# EAGLE design MPPT (EAGLE 7.2.0)
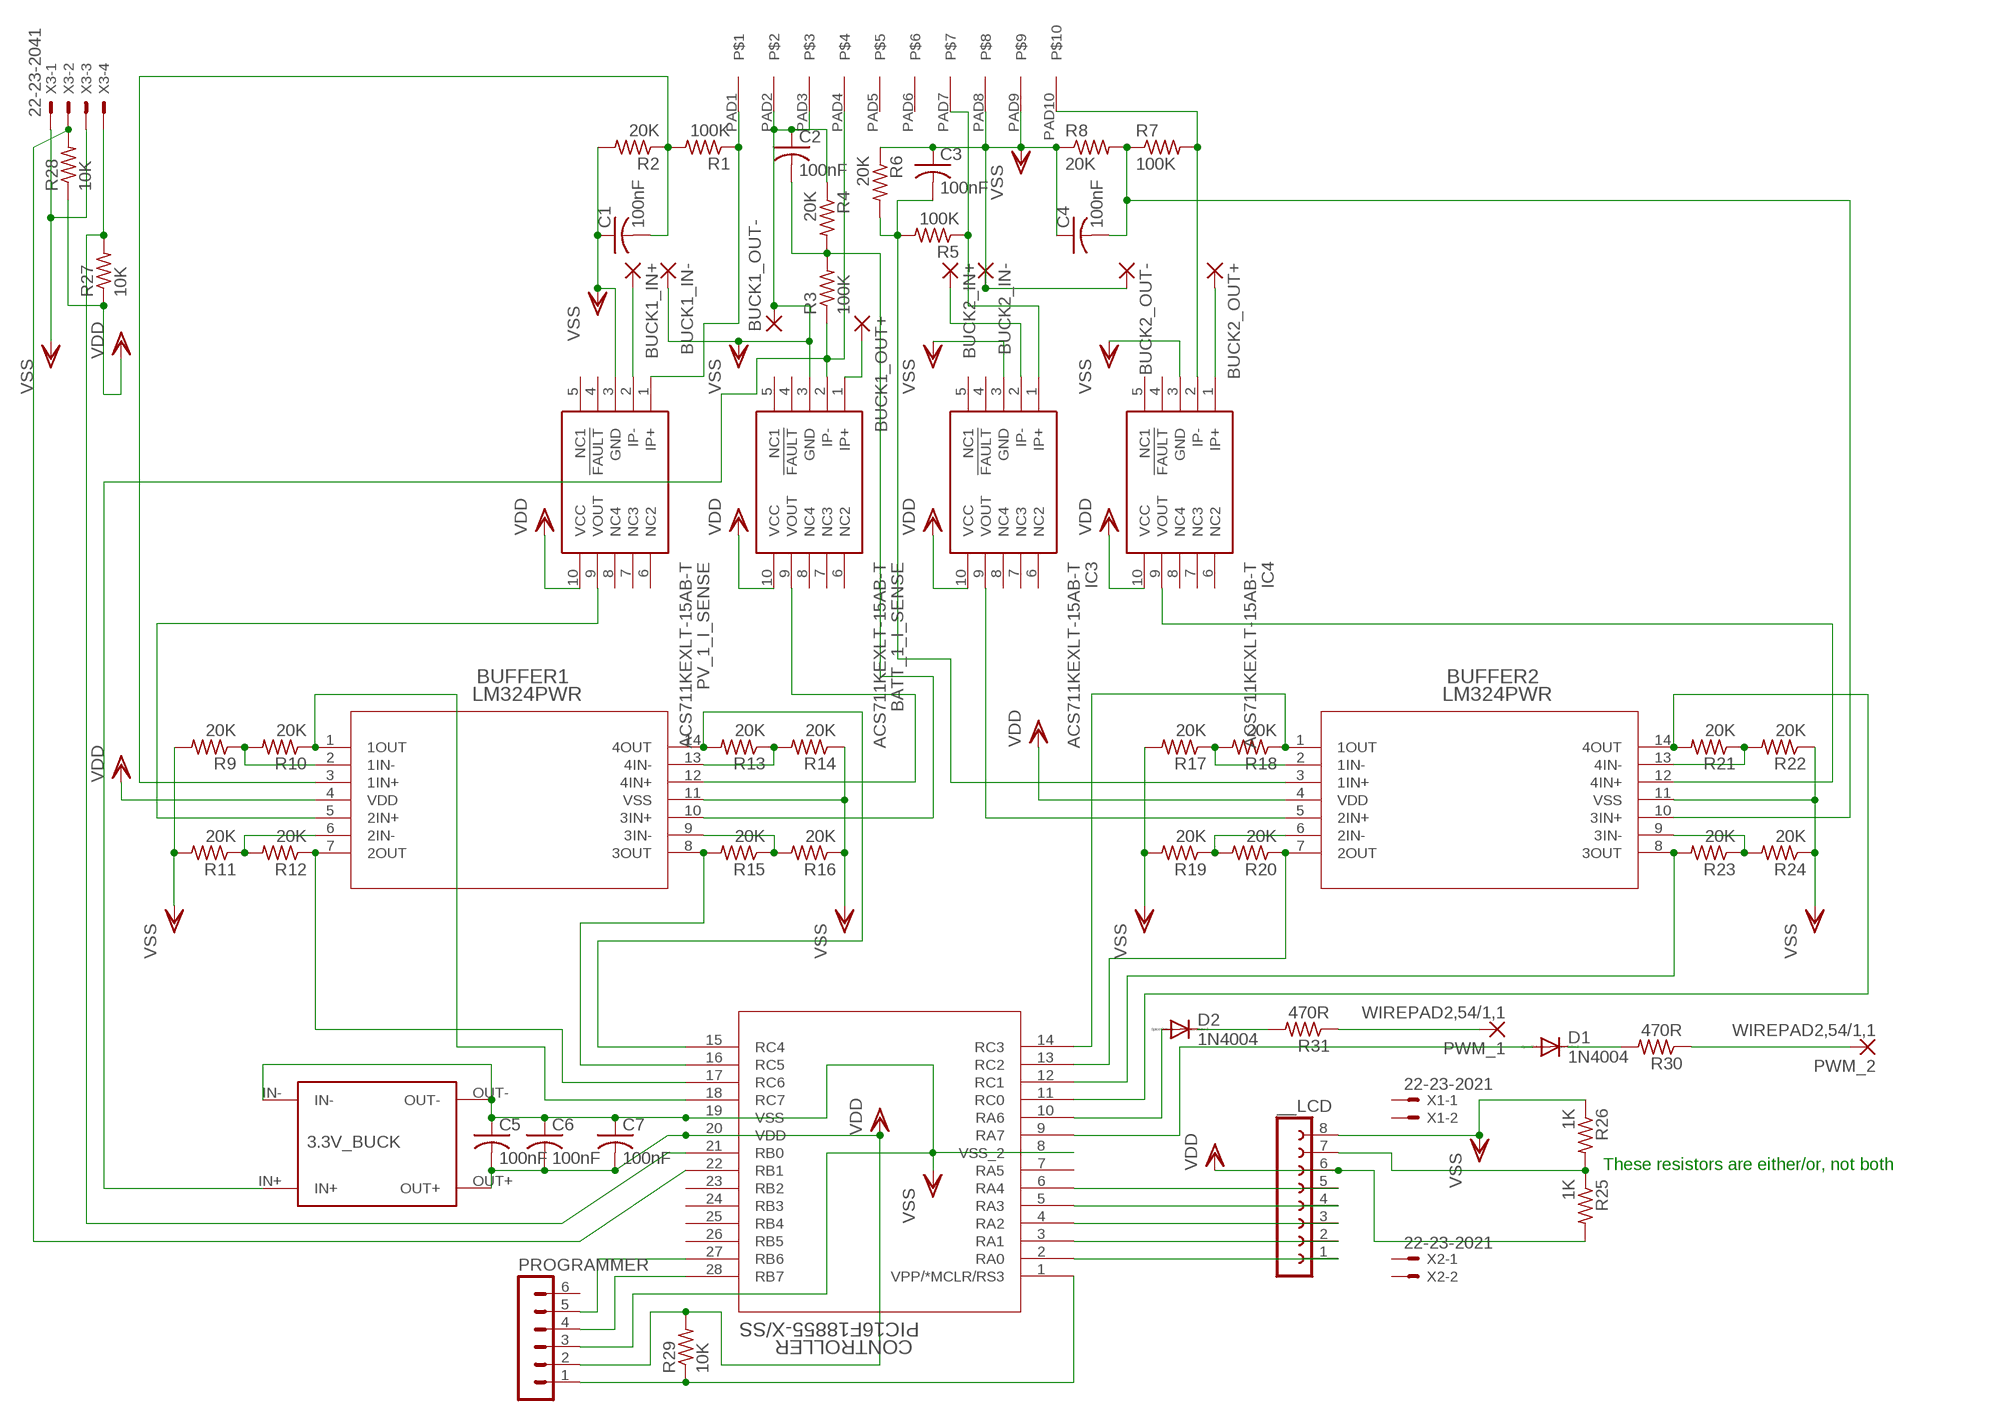
[diagram p0: schematic, sheet 1]

## Parts
3.3V_BUCK  TINY_BUCK  [TINY_BUCK]
__LCD  FE08-1  [FE08]
BATT_1_I_SENSE  ACS711KEXLT-15AB-T  [EX-PACKAGE]
BUCK1_IN+  3,81/1,4  [3,81/1,4]
BUCK1_IN-  3,81/1,4  [3,81/1,4]
BUCK1_OUT+  3,81/1,4  [3,81/1,4]
BUCK1_OUT-  3,81/1,4  [3,81/1,4]
BUCK2_IN+  3,81/1,4  [3,81/1,4]
BUCK2_IN-  3,81/1,4  [3,81/1,4]
BUCK2_OUT+  3,81/1,4  [3,81/1,4]
BUCK2_OUT-  3,81/1,4  [3,81/1,4]
BUFFER1  LM324PWR  [PW14]
BUFFER2  LM324PWR  [PW14]
C1  100nF  C-USC0603  [C0603]
C2  100nF  C-USC0603  [C0603]
C3  100nF  C-USC0603  [C0603]
C4  100nF  C-USC0603  [C0603]
C5  100nF  C-USC0603  [C0603]
C6  100nF  C-USC0603  [C0603]
C7  100nF  C-USC0603  [C0603]
CONTROLLER  PIC16F18855-X/SS  [SSOP28_MC]
D1  1N4004  [DO41-10]
D2  1N4004  [DO41-10]
IC3  ACS711KEXLT-15AB-T  [EX-PACKAGE]
IC4  ACS711KEXLT-15AB-T  [EX-PACKAGE]
PROGRAMMER  MA06-1  [MA06-1]
PV_1_I_SENSE  ACS711KEXLT-15AB-T  [EX-PACKAGE]
PWM_1  WIREPAD2,54/1,1  [2,54/1,1]
PWM_2  WIREPAD2,54/1,1  [2,54/1,1]
R1  100K  R-US_R0603  [R0603]
R2  20K  R-US_R0603  [R0603]
R3  100K  R-US_R0603  [R0603]
R4  20K  R-US_R0603  [R0603]
R5  100K  R-US_R0603  [R0603]
R6  20K  R-US_R0603  [R0603]
R7  100K  R-US_R0603  [R0603]
R8  20K  R-US_R0603  [R0603]
R9  20K  R-US_R0603  [R0603]
R10  20K  R-US_R0603  [R0603]
R11  20K  R-US_R0603  [R0603]
R12  20K  R-US_R0603  [R0603]
R13  20K  R-US_R0603  [R0603]
R14  20K  R-US_R0603  [R0603]
R15  20K  R-US_R0603  [R0603]
R16  20K  R-US_R0603  [R0603]
R17  20K  R-US_R0603  [R0603]
R18  20K  R-US_R0603  [R0603]
R19  20K  R-US_R0603  [R0603]
R20  20K  R-US_R0603  [R0603]
R21  20K  R-US_R0603  [R0603]
R22  20K  R-US_R0603  [R0603]
R23  20K  R-US_R0603  [R0603]
R24  20K  R-US_R0603  [R0603]
R25  1K  R-US_R0603  [R0603]
R26  1K  R-US_R0603  [R0603]
R27  10K  R-US_R1206  [R1206]
R28  10K  R-US_R0603  [R0603]
R29  10K  R-US_R0603  [R0603]
R30  470R  R-US_R0603  [R0603]
R31  470R  R-US_R1206  [R1206]
U$1  CONN-KF2EDG-10(5.08)E-BAYPLUGGABLECONNECTORS  [CONN-KF2EDG-10(5.08)]
X1  22-23-2021  [22-23-2021]
X2  22-23-2021  [22-23-2021]
X3  22-23-2041  [22-23-2041]

## Nets
N$1: PV_1_I_SENSE.1(IP+) R1.1 U$1.PAD1
N$2: BUFFER1.5(2IN+) PV_1_I_SENSE.9(VOUT)
N$3: BUFFER1.3(1IN+) C1.2 R1.2 R2.1
N$4: BATT_1_I_SENSE.1(IP+) BUCK1_OUT+.1(P)
N$5: BUFFER1.10(3IN+) C2.2 R3.2 R4.2
N$6: 3.3V_BUCK.IN+ BATT_1_I_SENSE.2(IP-) R3.1 U$1.PAD4
N$7: BUCK2_OUT+.1(P) IC4.1(IP+)
N$8: IC3.1(IP+) R5.1 U$1.PAD7
N$9: BUCK2_IN+.1(P) IC3.2(IP-)
N$10: BUFFER2.3(1IN+) C3.2 R5.2 R6.2
N$11: IC4.2(IP-) R7.2 U$1.PAD10
N$12: BUFFER2.10(3IN+) C4.2 R7.1 R8.2
N$13: BUCK1_IN+.1(P) PV_1_I_SENSE.2(IP-)
N$14: BUFFER1.9(3IN-) R15.1 R16.2
N$15: BUFFER1.1(1OUT) CONTROLLER.18(RC7) R10.1
N$16: BUFFER1.6(2IN-) R11.1 R12.2
N$17: BUFFER1.7(2OUT) CONTROLLER.17(RC6) R12.1
N$18: BUFFER1.13(4IN-) R13.1 R14.2
N$19: BUFFER1.2(1IN-) R9.1 R10.2
N$20: BUFFER1.14(4OUT) CONTROLLER.15(RC4) R13.2
N$21: BUFFER1.8(3OUT) CONTROLLER.16(RC5) R15.2
N$22: BATT_1_I_SENSE.9(VOUT) BUFFER1.12(4IN+)
N$23: __LCD.1 CONTROLLER.2(RA0)
N$24: BUFFER2.1(1OUT) CONTROLLER.14(RC3) R18.1
N$25: BUFFER2.7(2OUT) CONTROLLER.13(RC2) R20.1
N$26: BUFFER2.6(2IN-) R19.1 R20.2
N$27: BUFFER2.14(4OUT) CONTROLLER.11(RC0) R21.2
N$28: BUFFER2.13(4IN-) R21.1 R22.2
N$29: BUFFER2.8(3OUT) CONTROLLER.12(RC1) R23.2
N$30: BUFFER2.9(3IN-) R23.1 R24.2
N$31: BUFFER2.2(1IN-) R17.1 R18.2
N$32: BUFFER2.5(2IN+) IC3.9(VOUT)
N$33: BUFFER2.12(4IN+) IC4.9(VOUT)
N$34: __LCD.2 CONTROLLER.3(RA1)
N$35: __LCD.3 CONTROLLER.4(RA2)
N$36: __LCD.4 CONTROLLER.5(RA3)
N$37: __LCD.5 CONTROLLER.6(RA4)
N$38: __LCD.7 R25.1 R26.2
N$39: CONTROLLER.22(RB1) R28.2 X3.2
N$40: CONTROLLER.1(VPP/*MCLR/RS3) PROGRAMMER.1 R29.1
N$41: CONTROLLER.10(RA6) D2.A
N$42: CONTROLLER.21(RB0) R27.2 X3.4
N$43: CONTROLLER.9(RA7) D1.A
N$44: CONTROLLER.28(RB7) PROGRAMMER.4
N$45: CONTROLLER.27(RB6) PROGRAMMER.5
N$46: PWM_2.1(P) R30.1
N$47: D1.C R30.2
N$48: PWM_1.1(P) R31.1
N$49: D2.C R31.2
VDD: 3.3V_BUCK.OUT+ __LCD.6 BATT_1_I_SENSE.10(VCC) BUFFER1.4(VDD) BUFFER2.4(VDD) C5.2 C6.2 C7.2 CONTROLLER.20(VDD) IC3.10(VCC) IC4.10(VCC) PROGRAMMER.2 PV_1_I_SENSE.10(VCC) R25.2 R27.1 R28.1 R29.2
VSS: 3.3V_BUCK.IN- 3.3V_BUCK.OUT- __LCD.8 BATT_1_I_SENSE.3(GND) BUCK1_IN-.1(P) BUCK1_OUT-.1(P) BUCK2_IN-.1(P) BUCK2_OUT-.1(P) BUFFER1.11(VSS) BUFFER2.11(VSS) C1.1 C2.1 C3.1 C4.1 C5.1 C6.1 C7.1 CONTROLLER.8(VSS_2) CONTROLLER.19(VSS) IC3.3(GND) IC4.3(GND) PROGRAMMER.3 PV_1_I_SENSE.3(GND) R2.2 R4.1 R6.1 R8.1 R9.2 R11.2 R14.1 R16.1 R17.2 R19.2 R22.1 R24.1 R26.1 U$1.PAD2 U$1.PAD3 U$1.PAD8 U$1.PAD9 X3.1 X3.3
Unconnected: BATT_1_I_SENSE.4(!FAULT) BATT_1_I_SENSE.5(NC1) BATT_1_I_SENSE.6(NC2) BATT_1_I_SENSE.7(NC3) BATT_1_I_SENSE.8(NC4) CONTROLLER.7(RA5) CONTROLLER.23(RB2) CONTROLLER.24(RB3) CONTROLLER.25(RB4) CONTROLLER.26(RB5) IC3.4(!FAULT) IC3.5(NC1) IC3.6(NC2) IC3.7(NC3) IC3.8(NC4) IC4.4(!FAULT) IC4.5(NC1) IC4.6(NC2) IC4.7(NC3) IC4.8(NC4) PROGRAMMER.6 PV_1_I_SENSE.4(!FAULT) PV_1_I_SENSE.5(NC1) PV_1_I_SENSE.6(NC2) PV_1_I_SENSE.7(NC3) PV_1_I_SENSE.8(NC4) U$1.PAD5 U$1.PAD6 X1.1 X1.2 X2.1 X2.2

## Notes on the sheet
- These resistors are either/or, not both

## Library data of the parts
3.3V_BUCK = Tiny_Buck:TINY_BUCK: E_Bay 3 Amp Buck Converter
__LCD = con-lsta:FE08-1: FEMALE HEADER; OC_FARNELL: unknown; OC_NEWARK: unknown
BATT_1_I_SENSE IC3 IC4 PV_1_I_SENSE = SamacSys_Parts:ACS711KEXLT-15AB-T: Hall Effect Linear Current Sensor with Overcurrent Fault Output for <100 V Isolation Applications Source: Datasheet <https://www.arrow.com/en/products/acs711kexlt-15ab-t/allegro-microsystems>; ARROW_PART_NUMBER: ACS711KEXLT-15AB-T; DESCRIPTION: Hall Effect Linear Current Sensor with Overcurrent Fault Output for <100 V Isolation Applications; HEIGHT: mm; MANUFACTURER_NAME: Allegro Microsystems; MANUFACTURER_PART_NUMBER: ACS711KEXLT-15AB-T
BUCK1_IN+ BUCK1_IN- BUCK1_OUT+ BUCK1_OUT- BUCK2_IN+ BUCK2_IN- BUCK2_OUT+ BUCK2_OUT- = wirepad:3,81/1,4: THROUGH-HOLE PAD
BUFFER1 BUFFER2 = LM324PWR:LM324PWR; MANUFACTURER_PART_NUMBER: LM324PWR; VENDOR: Vendor
C1-C7 = resistor:C-US: CAPACITOR, American symbol
CONTROLLER = 16F18855_SSOP:PIC16F18855-X/SS; COPYRIGHT: Copyright (C) 2016 Accelerated Designs. All rights reserved; MANUFACTURER_PART_NUMBER: pic16f18855-x/ss; VENDOR: Microchip
D1 D2 = diode:1N4004: DIODE general purpose rectifier, 1 A
PROGRAMMER = con-lstb:MA06-1: PIN HEADER; OC_FARNELL: unknown; OC_NEWARK: unknown
PWM_1 PWM_2 = wirepad:WIREPAD: Wire PAD connect wire on PCB
R1-R26 R28-R31 = resistor:R-US_: RESISTOR, American symbol
R27 = rcl:R-US_: RESISTOR, American symbol
U$1 = Stuff_I_Use:CONN-KF2EDG-10(5.08)
X1 X2 = con-molex:22-23-2021: .100" (2.54mm) Center Header - 2 Pin; MF: MOLEX; MPN: 22-23-2021; OC_FARNELL: 1462926; OC_NEWARK: 25C3832
X3 = con-molex:22-23-2041: .100" (2.54mm) Center Header - 4 Pin; MF: MOLEX; MPN: 22-23-2041; OC_FARNELL: 1462920; OC_NEWARK: 38C0355

## Board
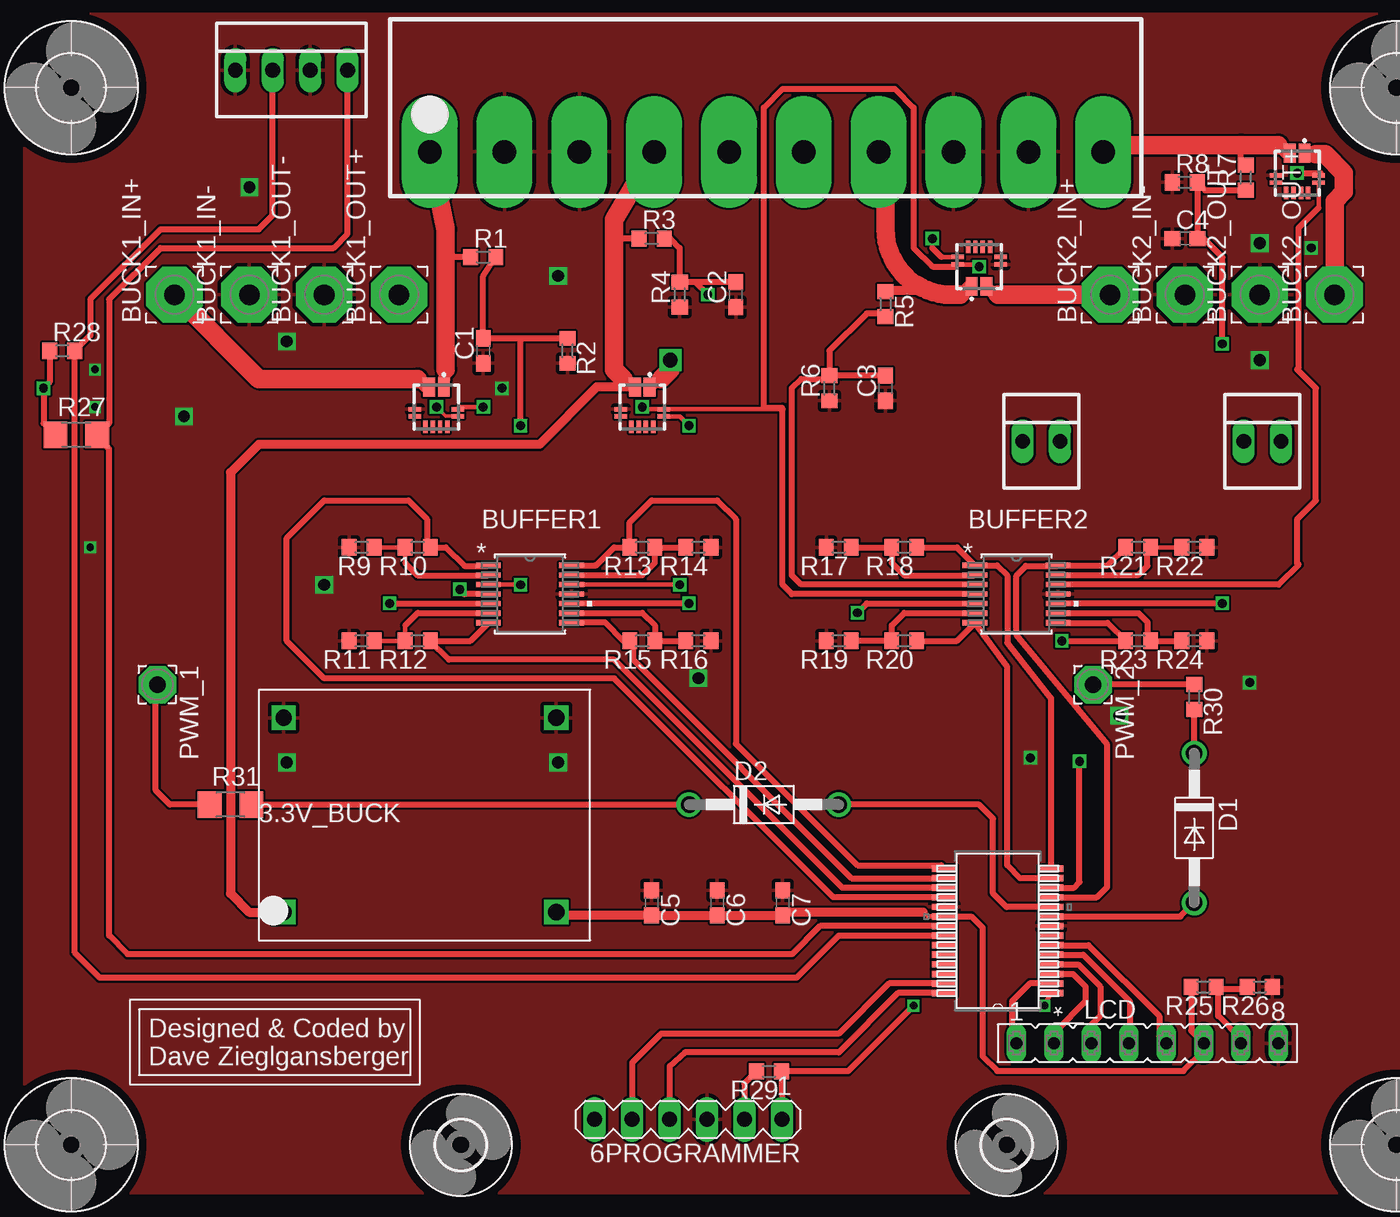
[diagram p1: board, top side]
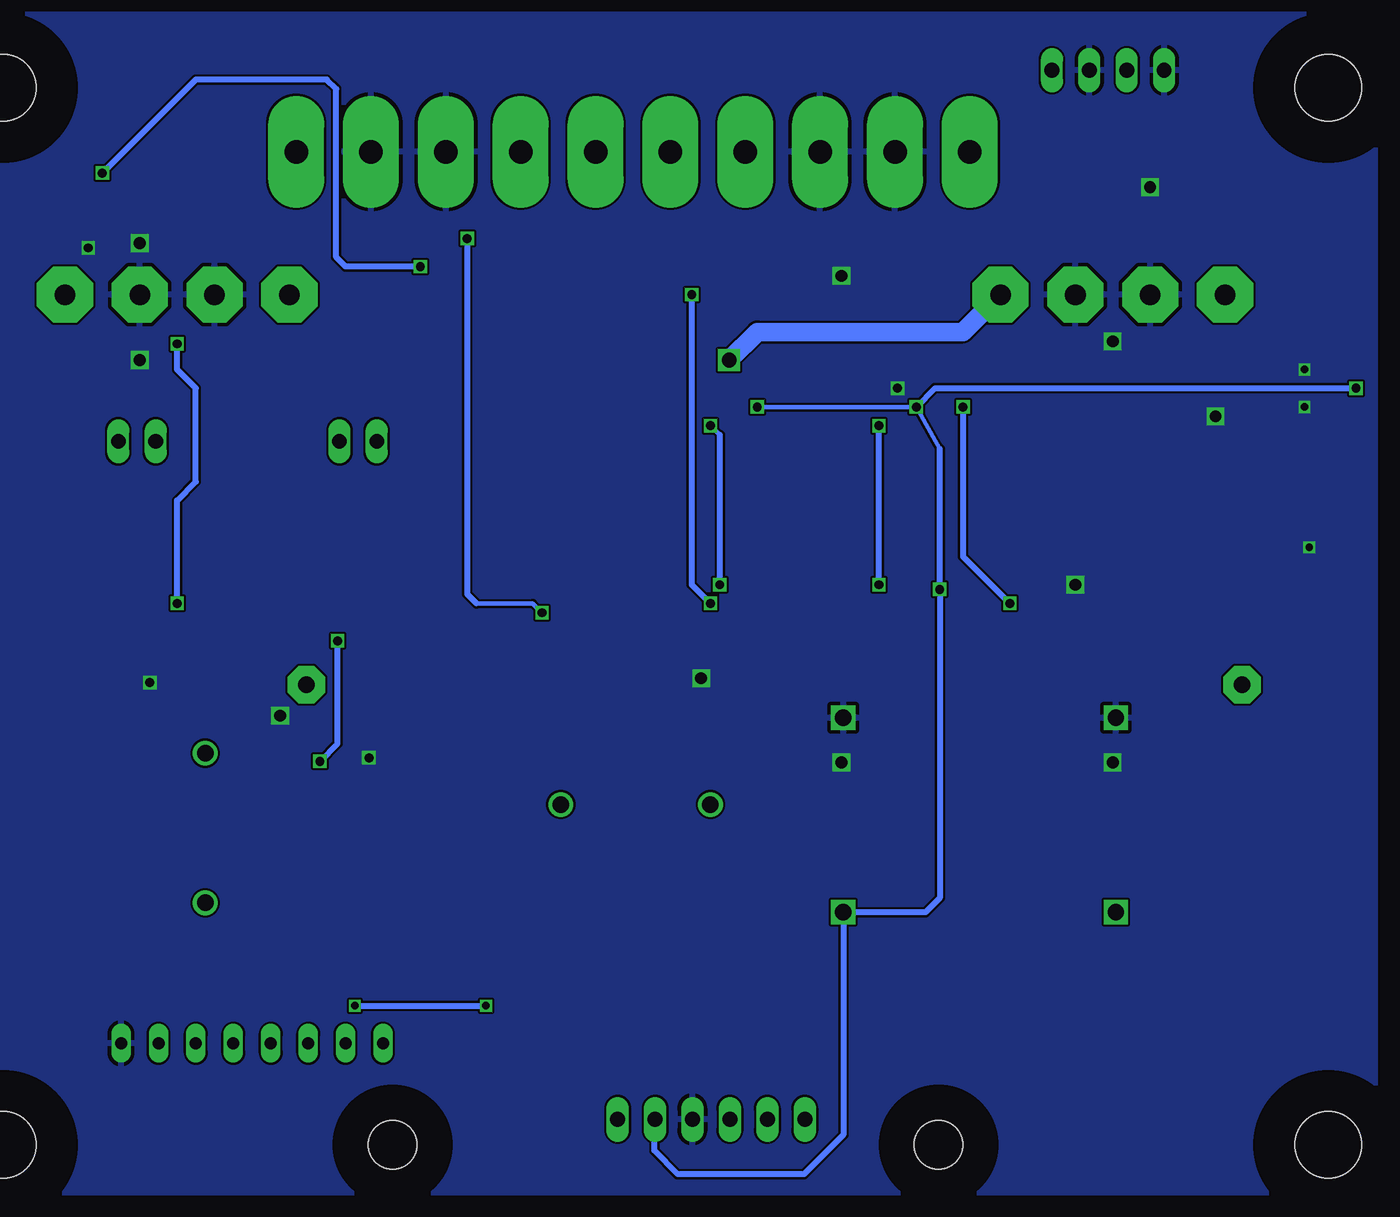
[diagram p2: board, bottom side, seen from below]

No outline drawn. Coordinates in mm, seen from the top.
Copper layers (1*16): Top 0.035mm / dielectric 1.5mm / Bottom 0.035mm
Design rules "SeeedStudio_2layer_DRU_no_angle_20140221 *": minimum track width 6mil, minimum drill 12mil, track to track 6mil, track to pad 6mil, pad to pad 6mil, via to via 6mil, smd to smd 0mil, copper to edge 10mil, drill to drill 10mil, minimum pad ring 10mil, minimum via ring 6mil, stop-mask expansion 2mil, vias tented up to drill 100mil, thermal gap 10mil

### Footprints (pad centres in the part's own frame; a part is rotated, then mirrored left to right if it is on the bottom)
TINY_BUCK = drill 1.1 square: IN+ 1.7,1.9; IN- 1.7,15.1; OUT+ 20.2,1.9; OUT- 20.2,15.1
FE08 = drill 0.813 long: 1 -8.89,0; 2 -6.35,0; 3 -3.81,0; 4 -1.27,0; 5 1.27,0; 6 3.81,0; 7 6.35,0; 8 8.89,0
EX-PACKAGE = smd 1.27 x 0.8: 1 -1.35,0.5; 2 -1.35,-0.5 | smd 0.3 x 0.85: 3 0.15,-1.45; 4 0.65,-1.45; 9 0.65,1.45; 10 0.15,1.45 | smd 0.85 x 0.3: 5 1.35,-0.75; 6 1.35,-0.25; 7 1.35,0.25; 8 1.35,0.75
3,81/1,4 = drill 1.397 pad 3.81 octagon: 1 0,0
PW14 = smd 1.676 x 0.356: 1 -2.819,1.95; 2 -2.819,1.3; 3 -2.819,0.65; 4 -2.819,0; 5 -2.819,-0.65; 6 -2.819,-1.3; 7 -2.819,-1.95; 8 2.819,-1.95; 9 2.819,-1.3; 10 2.819,-0.65; 11 2.819,0; 12 2.819,0.65; 13 2.819,1.3; 14 2.819,1.95
C0603 = smd 1.1 x 1: 1 -0.85,0; 2 0.85,0
SSOP28_MC = smd 1.676 x 0.432: 1 -3.619,4.225; 2 -3.619,3.575; 3 -3.619,2.925; 4 -3.619,2.275; 5 -3.619,1.625; 6 -3.619,0.975; 7 -3.619,0.325; 8 -3.619,-0.325; 9 -3.619,-0.975; 10 -3.619,-1.625; 11 -3.619,-2.275; 12 -3.619,-2.925; 13 -3.619,-3.575; 14 -3.619,-4.225; 15 3.619,-4.225; 16 3.619,-3.575; 17 3.619,-2.925; 18 3.619,-2.275; 19 3.619,-1.625; 20 3.619,-0.975; 21 3.619,-0.325; 22 3.619,0.325; 23 3.619,0.975; 24 3.619,1.625; 25 3.619,2.275; 26 3.619,2.925; 27 3.619,3.575; 28 3.619,4.225
DO41-10 = drill 1.118: A 5.08,0; C -5.08,0
MA06-1 = drill 1.016 long: 1 -6.35,0; 2 -3.81,0; 3 -1.27,0; 4 1.27,0; 5 3.81,0; 6 6.35,0
2,54/1,1 = drill 1.118 pad 2.54 octagon: 1 0,0
R0603 = smd 1 x 1.1: 1 -0.85,0; 2 0.85,0
R1206 = smd 1.6 x 1.803: 1 -1.422,0; 2 1.422,0
CONN-KF2EDG-10(5.08) = drill 1.6 pad 3.81 long: PAD1 23.32,3; PAD2 18.24,3; PAD3 13.16,3; PAD4 8.08,3; PAD5 3,3; PAD6 -2.08,3; PAD7 -7.16,3; PAD8 -12.24,3; PAD9 -17.32,3; PAD10 -22.4,3
4,5 = hole 4.5: 0,0
3,3 = hole 3.3: 0,0
22-23-2021 = drill 1 long: 1 -1.27,0; 2 1.27,0
22-23-2041 = drill 1 long: 1 -3.81,0; 2 -1.27,0; 3 1.27,0; 4 3.81,0

### Placement (x,y rotation side)
3.3V_BUCK  15.88,17.14 0 top
__LCD  76.2,10.16 0 top
BATT_1_I_SENSE  41.91,53.34 270 top
BUCK1_IN+  10.16,60.96 90 top
BUCK1_IN-  15.24,60.96 90 top
BUCK1_OUT+  25.4,60.96 90 top
BUCK1_OUT-  20.32,60.96 90 top
BUCK2_IN+  73.66,60.96 90 top
BUCK2_IN-  78.74,60.96 90 top
BUCK2_OUT+  88.9,60.96 90 top
BUCK2_OUT-  83.82,60.96 90 top
BUFFER1  34.29,40.64 0 top
BUFFER2  67.31,40.64 0 top
C1  31.11,57.15 90 top
C2  48.26,60.96 90 top
C3  58.42,54.61 90 top
C4  78.74,64.77 0 top
C5  42.55,19.68 270 top
C6  46.99,19.68 270 top
C7  51.44,19.68 270 top
CONTROLLER  66.04,17.78 180 top
D1  79.38,24.77 270 top
D2  50.16,26.35 0 top
IC3  64.77,62.87 90 top
IC4  86.36,69.22 270 top
PROGRAMMER  45.03,4.98 180 top
PV_1_I_SENSE  27.94,53.34 270 top
PWM_1  9,34.5 270 top
PWM_2  72.5,34.5 270 top
R1  31.11,63.5 0 top
R2  36.83,57.15 270 top
R3  42.55,64.77 0 top
R4  44.45,60.96 90 top
R5  58.42,60.33 270 top
R6  54.61,54.61 90 top
R7  82.87,68.9 90 top
R8  78.74,68.58 0 top
R9  22.86,43.81 180 top
R10  26.67,43.81 180 top
R11  22.86,37.47 180 top
R12  26.67,37.47 180 top
R13  41.91,43.81 180 top
R14  45.72,43.81 180 top
R15  41.91,37.47 180 top
R16  45.72,37.47 180 top
R17  55.24,43.81 180 top
R18  59.69,43.81 180 top
R19  55.24,37.47 180 top
R20  59.69,37.47 180 top
R21  75.56,43.81 180 top
R22  79.38,43.81 180 top
R23  75.56,37.47 180 top
R24  79.38,37.47 180 top
R25  80.01,13.97 180 top
R26  83.82,13.97 180 top
R27  3.49,51.44 0 top
R28  2.54,57.15 0 top
R29  50.52,8.24 180 top
R30  79.38,33.66 270 top
R31  13.97,26.35 0 top
U$1  50.8,73.66 180 top
U$2  [4,5]  3.15,75 0 top
U$3  [4,5]  93.1,3.25 0 top
U$4  [4,5]  3.15,3.25 0 top
U$5  [4,5]  93.1,75 0 top
U$7  [DAVE]  8.4,8.64 0 top
U$8  [3,3]  29.6,3.25 0 top
U$9  [3,3]  66.65,3.25 0 top
X1  69,51 0 top
X2  84,51 0 top
X3  18.1,76.2 0 top

### Tracks (layer width: path | path; a pad name or v marks a point on that pad's centre or on a via)
N$1
  Top 0.406: R1.1 28.57,63.5
  Top 0.813: PV_1_I_SENSE.1 28.57,55.88
  Top 1.27: 28.57,55.88 28.57,63.5 28.57,65.41 U$1.PAD1
N$2  (via drill 0.6)
  Top 0.254: v27.94,53.34 28.57,52.7 29.38,52.7 PV_1_I_SENSE.9
  Top 0.305: 31.46,40.01 BUFFER1.5
  Top 0.406: v24.77,40.01 31.46,40.01
  Bottom 0.406: v27.94,53.34 27.94,43.18 v24.77,40.01
N$3  (via drill 0.6)
  Top 0.305: BUFFER1.3 33.64,41.29 v33.66,41.27
  Top 0.406: 33.66,58 C1.2 31.11,62.23 R1.2 | 33.66,58 R2.1 | v33.66,52.07 33.66,58
  Bottom 0.406: v33.66,41.27 v33.66,52.07
N$4  (via drill 1)
  Top 0.813: BATT_1_I_SENSE.1 42.97,55.24 43.18,55.24
  Top 1.27: 43.18,55.24 43.81,55.88 v43.81,56.52
  Bottom 1.27: v43.81,56.52 41.91,58.42 27.94,58.42 BUCK1_OUT+.1
N$5  (via drill 0.6)
  Top 0.305: R3.2 43.81,64.77 | R4.2 45.51,61.81 | 37.12,40.01 BUFFER1.10
  Top 0.406: C2.2 R4.2 44.45,64.14 43.81,64.77 | 45.51,61.81 v46.35,60.96 | v45.09,40.01 37.12,40.01
  Bottom 0.406: v46.35,60.96 46.35,41.27 v45.09,40.01
N$6
  Top 0.406: R3.1 40.01,64.77
  Top 0.61: 41.2,54.69 38.81,54.69 34.92,50.8 15.88,50.8 13.97,48.9 13.97,20.32 15.24,19.05 3.3V_BUCK.IN+
  Top 0.813: 40.64,55.24 41.2,54.69 BATT_1_I_SENSE.2
  Top 1.27: 40.64,55.24 40.01,55.88 40.01,64.77 40.01,66.04 U$1.PAD4
N$7
  Top 0.813: 87.63,70.48 86.94,70.48 IC4.1
  Top 1.27: BUCK2_OUT+.1 88.9,67.31 89.53,67.94 89.53,69.22 88.27,70.48 87.63,70.48
N$8
  Top 0.61: R5.1 58.52,61.28 63.82,61.28
  Top 0.813: 63.5,60.96 63.82,61.28 64.06,61.52 IC3.1
  Top 1.27: U$1.PAD7 58.42,70.2 58.42,65.41 arc90 62.87,60.96 63.5,60.96
N$9
  Top 0.813: IC3.2 65.83,60.96 66.04,60.96
  Top 1.27: 66.04,60.96 BUCK2_IN+.1
N$10
  Top 0.305: R5.2 58.42,59.69 | 54.4,55.24 R6.2
  Top 0.406: C3.2 R6.2 54.61,57.15 57.15,59.69 58.42,59.69 | BUFFER2.3 52.69,41.29 52.07,41.91 52.07,54.61 52.7,55.24 54.4,55.24
N$11
  Top 0.305: R7.2 82.55,70.06
  Top 0.406: 82.55,70.06 82.55,71.12
  Top 0.813: 85.09,71.12 85.64,70.56 IC4.2
  Top 1.27: U$1.PAD10 73.66,71.12 82.55,71.12 85.09,71.12
N$12  (via drill 0.6)
  Top 0.305: 70.14,40.01 BUFFER2.10
  Top 0.406: v81.28,40.01 70.14,40.01 | v81.28,57.62 81.28,63.5 80.01,64.77 C4.2 R8.2 80.12,68.05 R7.1
  Bottom 0.406: v81.28,40.01 81.28,46.99 80.01,48.26 80.01,54.61 81.28,55.88 v81.28,57.62
N$13
  Top 0.813: 26.67,55.24 27.23,54.69 PV_1_I_SENSE.2
  Top 1.27: BUCK1_IN+.1 15.88,55.24 26.67,55.24
N$14
  Top 0.305: BUFFER1.9 37.14,39.37
  Top 0.406: 37.14,39.37 41.91,39.37 42.76,38.52 R15.1 R16.2
N$15
  Top 0.305: 31.43,42.55 BUFFER1.1 | 27.3,44.03 R10.1
  Top 0.406: R10.1 28.57,43.81 29.84,42.55 31.43,42.55 | CONTROLLER.18 54.88,20.05 40.01,34.92 20.32,34.92 17.78,37.47 17.78,44.45 20.32,46.99 26.04,46.99 27.3,45.72 27.3,44.03
N$16
  Top 0.305: R11.1 R12.2 25.82,38.52 | 31.44,39.37 BUFFER1.6
  Top 0.406: 25.82,38.52 26.67,39.37 31.44,39.37
N$17
  Top 0.305: 31.43,38.73 BUFFER1.7
  Top 0.406: BUFFER1.7 30.25,37.47 R12.1 28.79,36.2 40.01,36.2 55.49,20.7 CONTROLLER.17
N$18
  Top 0.305: 41.88,41.94 41.91,41.91
  Top 0.406: BUFFER1.13 41.88,41.94 | 41.91,41.91 42.76,42.76 R13.1 R14.2
N$19
  Top 0.305: R9.1 R10.2 25.82,42.76 | 31.44,41.91 BUFFER1.2
  Top 0.406: 25.82,42.76 26.67,41.91 31.44,41.91
N$20
  Top 0.305: 38.69,42.59 38.73,42.55 | 62.2,22.23 CONTROLLER.15
  Top 0.406: BUFFER1.14 38.69,42.59 | 38.73,42.55 40.01,43.81 R13.2 41.06,45.51 42.55,46.99 46.99,46.99 48.26,45.72 48.26,30.48 56.52,22.23 62.2,22.23
N$21
  Top 0.305: BUFFER1.8 37.15,38.73 | 40.64,37.47 R15.2 41.27,37.25
  Top 0.406: 37.15,38.73 39.37,38.73 40.64,37.47 | 41.27,37.25 41.27,36.2 56.12,21.36 CONTROLLER.16
N$22  (via drill 0.6)
  Top 0.305: BUFFER1.12 44.44,41.29 v44.45,41.27 | v45.09,52.07 44.47,52.69 BATT_1_I_SENSE.9
  Bottom 0.305: 44.45,51.44 v45.09,52.07
  Bottom 0.406: v44.45,41.27 44.45,51.44
N$23
  Top 0.406: CONTROLLER.2 68.2,14.21 67,13 67,10.47 __LCD.1
N$24
  Top 0.305: 69.65,22.2 CONTROLLER.14
  Top 0.406: R18.1 63.27,43.81 BUFFER2.1 66,42.59 66.67,41.91 66.67,37.34 69.65,33.56 69.65,22.2
N$25
  Top 0.406: R20.1 63.27,37.47 BUFFER2.7 66.67,35.71 66.67,22.23 67.55,21.36 CONTROLLER.13
N$26
  Top 0.305: 64.46,39.37 BUFFER2.6
  Top 0.406: R19.1 R20.2 58.84,38.52 59.69,39.37 64.46,39.37
N$27
  Top 0.305: 70.08,42.55 BUFFER2.14
  Top 0.406: BUFFER2.14 73.49,42.59 R21.2 | CONTROLLER.11 72.76,20.05 73.46,20.75 73.46,30.42 67.31,37.87 67.31,41.91 67.94,42.55 70.08,42.55
N$28
  Top 0.305: 76.2,43.6 R21.1 R22.2
  Top 0.406: BUFFER2.13 75.59,41.94 76.2,42.55 76.2,43.6
N$29  (via drill 0.6)
  Top 0.406: BUFFER2.8 73.49,38.69 R23.2 v70.39,37.47 | CONTROLLER.12 71.2,20.7 71.59,21.09 v71.59,29.29
  Bottom 0.406: v71.59,29.29 70.39,30.48 v70.39,37.47
N$30
  Top 0.305: 76.2,37.68 R23.1
  Top 0.406: BUFFER2.9 75.59,39.34 76.2,38.73 76.2,37.68 | R23.1 R24.2
N$31
  Top 0.305: 64.46,41.91 BUFFER2.2
  Top 0.406: R17.1 R18.2 58.84,42.76 59.69,41.91 64.46,41.91
N$32  (via drill 0.6)
  Top 0.305: IC3.9 62.22,63.52 | 61.59,64.14 v61.59,64.77 | 64.48,40.01 BUFFER2.5
  Top 0.406: 62.22,63.52 61.59,64.14 | v56.52,39.37 57.15,40.01 64.48,40.01
  Bottom 0.305: 60.96,40.01 57.15,40.01 v56.52,39.37
  Bottom 0.406: v61.59,64.77 61.59,40.64 60.96,40.01
N$33
  Top 0.305: IC4.9 87.81,66.86 | 70.14,41.27 BUFFER2.12
  Top 0.406: 87.81,66.86 86.46,65.5 86.46,55.98 86.36,55.88 87.63,54.61 87.63,46.99 86.36,45.72 86.36,42.74 86.46,42.65 85.09,41.27 70.14,41.27
N$34
  Top 0.406: CONTROLLER.3 71.14,14.86 72,14 72,13 70,11 70,10.31 __LCD.2
N$35
  Top 0.406: CONTROLLER.4 71.5,15.51 73,14 73,12 72,11 72,10.55 __LCD.3
N$36
  Top 0.406: CONTROLLER.5 71.84,16.16 75,13 75,10.23 __LCD.4
N$37
  Top 0.406: CONTROLLER.6 72.19,16.8 77,12 77,10.63 __LCD.5
N$38
  Top 0.406: __LCD.7 82.55,10.45 81,12 81,13.83 | 81,13.83 R25.1 | 81,13.83 82.83,13.83 R26.2
N$39
  Top 0.406: CONTROLLER.22 55.24,17.45 52.39,14.61 5.08,14.61 3.39,16.3 R28.2 4.45,58.2 4.45,60.64 9.21,65.41 15.88,65.41 16.83,66.36 X3.2
N$40  (via drill 0.5)
  Top 0.305: CONTROLLER.1 v69.22,12.7
  Top 0.406: v60.33,12.7 55.88,8.26 R29.1 PROGRAMMER.1
  Bottom 0.406: v69.22,12.7 v60.33,12.7
N$41
  Top 0.406: CONTROLLER.10 66.64,19.41 65.72,20.32 65.72,25.4 64.77,26.35 D2.A
N$42
  Top 0.406: CONTROLLER.21 53.98,18.11 52.07,16.19 6.99,16.19 5.71,17.46 5.71,50.48 4.92,51.28 R27.2 5.71,52.24 5.71,60.64 9.21,64.14 20.95,64.14 21.91,65.09 X3.4
N$43
  Top 0.406: CONTROLLER.9 78.44,18.75 D1.A
N$44
  Top 0.406: CONTROLLER.28 59.27,13.55 55.24,9.53 44.8,9.53 43.77,8.59 PROGRAMMER.4
N$45
  Top 0.406: CONTROLLER.27 58.66,14.21 55.24,10.79 43.2,10.79 41.23,8.82 PROGRAMMER.5
N$46
  Top 0.406: R30.1 PWM_2.1
N$47
  Top 0.406: D1.C R30.2
N$48
  Top 0.406: R31.1 9.84,26.35 8.89,27.3 8.89,34.39 PWM_1.1
N$49
  Top 0.406: R31.2 D2.C
VDD  (via drill 0.6)
  Top 0.305: v31.11,53.34 29.54,53.34 PV_1_I_SENSE.10 | v41.91,53.34 42.06,53.19 BATT_1_I_SENSE.10 51.44,53.19 51.44,53.34 50.16,53.34 | 63.17,62.87 IC3.10 64.62,63.02 v64.77,62.87 | 87.96,69.22 IC4.10 | CONTROLLER.20 61.3,18.75 60.96,19.05
  Top 0.406: BUFFER1.4 29.84,40.64 v29.53,40.96 | 50.16,53.34 50.16,73.66 51.44,74.93 59.05,74.93 60.33,73.66 60.33,64.14 61.59,62.87 63.17,62.87 | v86.36,69.22 87.96,69.22 | BUFFER2.4 52.07,40.64 51.44,41.27 51.44,53.19 | R25.2 79.16,11.01 __LCD.6 80.01,9.64 78.64,8.27 66,8.27 65,9.27 65,18 64.25,18.75 CONTROLLER.20 | R28.1 1.69,55.03 v1.27,54.61 1.27,52.24 R27.1 | R29.2 48.84,7.42 PROGRAMMER.2
  Top 0.61: 60.96,19.05 51.85,19.05 C7.2 C6.2 C5.2 36.28,18.84 3.3V_BUCK.OUT+
  Bottom 0.305: 29.53,50.48 v31.11,53.34 v41.91,53.34
  Bottom 0.406: 29.53,50.48 v29.53,40.96 29.53,20 30.48,19.05 3.3V_BUCK.OUT+ 36.08,3.93 38.73,1.27 47.31,1.27 48.9,2.86 48.9,4.93 PROGRAMMER.2 | v64.77,62.87 69.85,62.87 70.48,63.5 70.48,74.93 71.12,75.56 80.01,75.56 v86.36,69.22 | v31.11,53.34 29.84,54.61 v1.27,54.61
VSS  (via drill 0.5, 0.6, 0.8)
  other vias: 20.32,41.27 83.82,64.45 83.82,56.52 15.24,68.26 17.78,57.78 45.72,34.92 17.78,29.21 36.2,29.21 4.76,55.88 4.76,53.34 87.31,64.14 83.14,34.63 68.26,29.53 4.45,43.81 36.2,62.23 10.79,52.7 32.38,54.61 74.3,32.38
  pour Bottom: 0,0 100,0 100,80 0,80
  pour Top: 0,80.01 100.33,80.01 100.33,0 0,0